# Altium schematic sheet SMPS_5V_Analog.SchDoc
size A
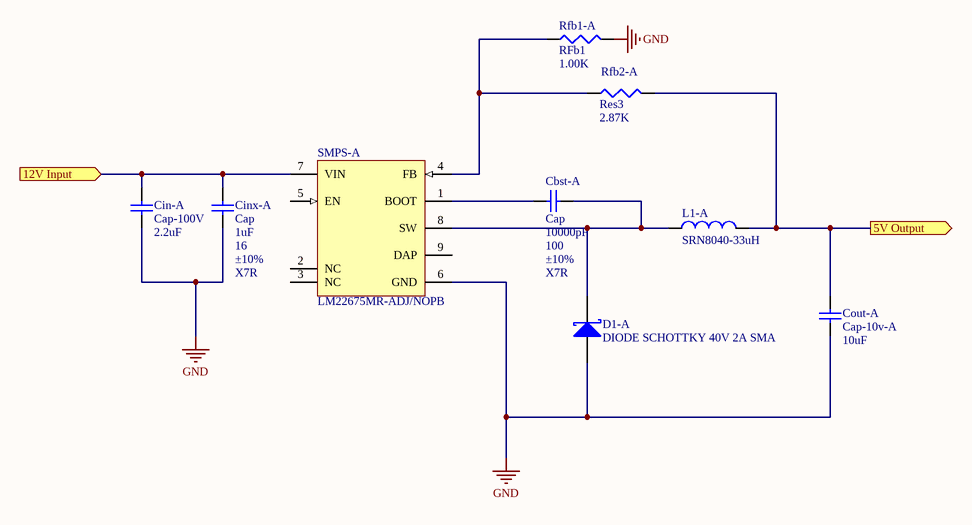
[diagram p0: SMPS_5V_Analog.SchDoc]

## Parts
Cbst-A  Cap  value 10000pF  WV: 100  Tolerance: ±10%  Type: X7R  [CAPC2012X09M]
Cin-A  Cap-100V  value 2.2uF  [C1210]
Cinx-A  Cap  value 1uF  WV: 16  Tolerance: ±10%  Type: X7R  [CAPC2012X09M]
Cout-A  Cap-10v-A  value 10uF  [C1210]
D1-A  DIODE SCHOTTKY 40V 2A SMA  [DIOM4326X23M]
L1-A  SRN8040-33uH  [INDP8080X40M]
Rfb1-A  RFb1  value 1.00K  [RESC2112X05M]
Rfb2-A  Res3  value 2.87K  [RESC2112X05M]
SMPS-A  LM22675MR-ADJ/NOPB  [MRA08B_L]

## Ports
5V Output (out), 12V Input (in)

## Nets
GND: Cin-A.1 Cinx-A.1 Cout-A.1 D1-A.2(A) Rfb1-A.2 SMPS-A.6(GND)
5V Output: Cout-A.2 L1-A.2 Rfb2-A.2 ; port 5V Output
12V Input: Cin-A.2 Cinx-A.2 SMPS-A.7(VIN) ; port 12V Input
NetCbst-A_1: Cbst-A.1 D1-A.1(K) L1-A.1 SMPS-A.8(SW)
NetCbst-A_2: Cbst-A.2 SMPS-A.1(BOOT)
NetRfb1-A_1: Rfb1-A.1 Rfb2-A.1 SMPS-A.4(FB)

Not connected (* = marked no-connect by the designer): SMPS-A 2(NC) 3(NC) 5(EN) 9(DAP)

## Library data of the parts
Cbst-A = CAP-X7R-10000pF-100V-±10%: CAP CER 10000pF 100v X7R 0805; MPN: C0805C103K1RACTU; PN: 399-1159-1-ND; Name: CAP-X7R-10000pF-100V-±10%; URL: http://www.digikey.ca/product-detail/en/C0805C103K1RACTU/399-1159-1-ND
Cin-A Cout-A = Cap: Capacitor; Published: 8-Jun-2000; LatestRevisionDate: 17-Jul-2002; LatestRevisionNote: Re-released for DXP Platform.; PackageReference: RAD-0.3; Publisher: Altium Limited; PackageDescription: Radial Cap, Thru-Hole; 2 Leads; 0.3 in Pin Spacing
Cinx-A = CAP-X7R-1uF-16V-±10%: CAP CER 1uF 16v X7R 0805; MPN: C0805C105K4RACTU; PN: 399-1284-1-ND; Name: CAP-X7R-1uF-16V-±10%; URL: http://www.digikey.ca/product-detail/en/C0805C105K4RACTU/399-1284-1-ND
D1-A = DIODE SCHOTTKY 40V 2A SMA: Schottky Rectifier; MPN: B240A-13-F; PN: B240A-FDICT-ND; URL: http://www.digikey.ca/product-detail/en/B240A-13-F/B240A-FDICT-ND
L1-A = SRN8040: FIXED IND 22UH 2.2A 100 MOHM SMD; MPN: SRN8040-220M; PN: SRN8040-220MCT-ND; URL: http://www.digikey.ca/product-detail/en/SRN8040-220M/SRN8040-220MCT-ND
Rfb1-A = Resistor_1.00K: RES SMD 1.00K OHM 1% 1/8W 0805; MPN: CRCW08051K00FKEA; PN: 541-1000KCCT-ND; Name: Resistor_1.00K; URL: http://www.digikey.ca/product-detail/en/CRCW08051K00FKEA/541-1000KCCT-ND
Rfb2-A = Resistor_2.87K: RES SMD 2.87K OHM 1% 1/8W 0805; MPN: CRCW08052K87FKEA; PN: 541-2870KCCT-ND; Name: Resistor_2.87K; URL: http://www.digikey.ca/product-detail/en/CRCW08052K87FKEA/541-2870KCCT-ND
SMPS-A = LM22675MR-ADJ/NOPB: 1A SIMPLE SWITCHER®, Step-Down Voltage Regulator with Precision Enable, 8-pin PSOP, Pb-Free; Manufacturer: National Semiconductor; MPN: LM22675MRE-ADJ/NOPB; PackageTopMarking: NSXYTT*L22675*ADJ; PowerWise: N; High-Reliability: Y; PN: LM22675MRE-ADJ/NOPBCT-ND; DatasheetVersion: Dec-2010; PackageVersion: revB, Dec-2007; PackageReference: MRA08B; PackageDescription: Molded, PSOP .193 x .154 x .058in, 8 Lead, .050in Pitch, Large DAP; PartNumber: LM22675MR-ADJ/NOPB; RoHS: Y; PinCount: 8; CompType: Switcher; Code_JEDEC: MS-012-AA; ComponentLink1Description: Manufacturer URL; ComponentLink1URL: http://www.national.com/; ComponentLink2Description: LM22675 Datasheet; ComponentLink2URL: http://www.national.com/ds/LM/LM22675.pdf; ComponentLink3Description: LM22675 Web Page; ComponentLink3URL: http://www.national.com/pf/LM/LM22675.html; ComponentLink4Description: MRA08B Package Page; ComponentLink4URL: http://www.national.com/packaging/folders/mra08b.html; URL: http://www.digikey.ca/product-detail/en/LM22675MRE-ADJ%2FNOPB/LM22675MRE-ADJ%2FNOPBCT-ND